# Altium schematic sheet ADC.SchDoc
size 420 x 594 mm; SheetNumber: 3; INDEX: СЛИЮ.687282.064 Э3
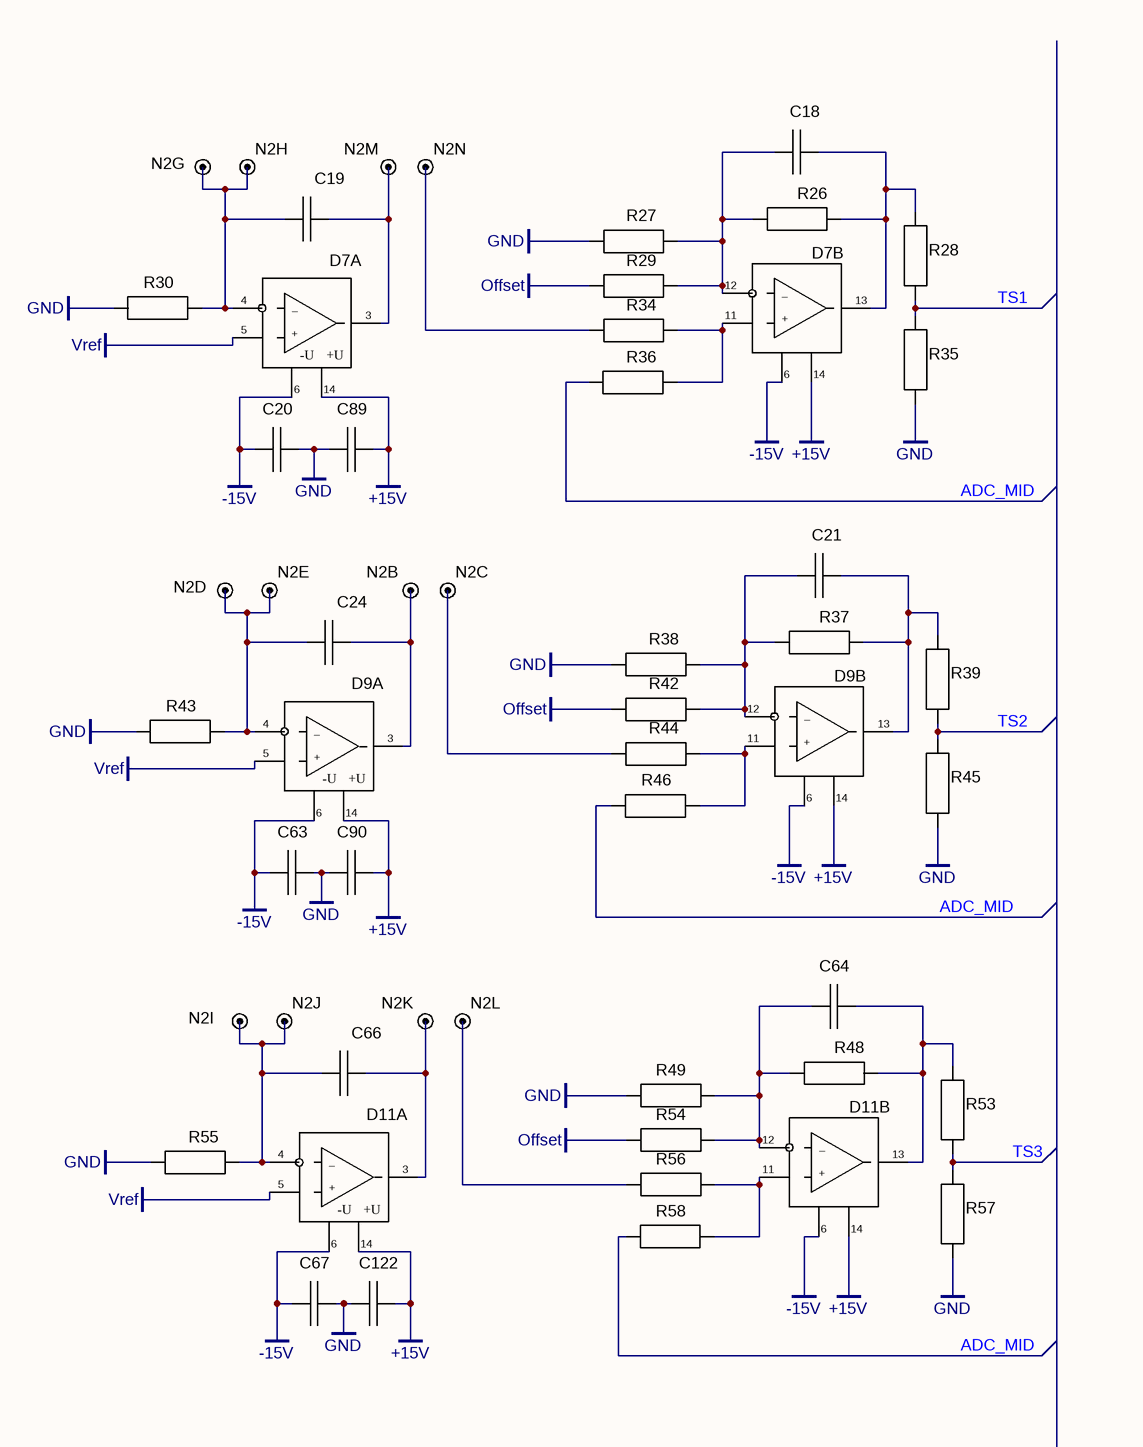
[diagram p0: ADC.SchDoc, top]
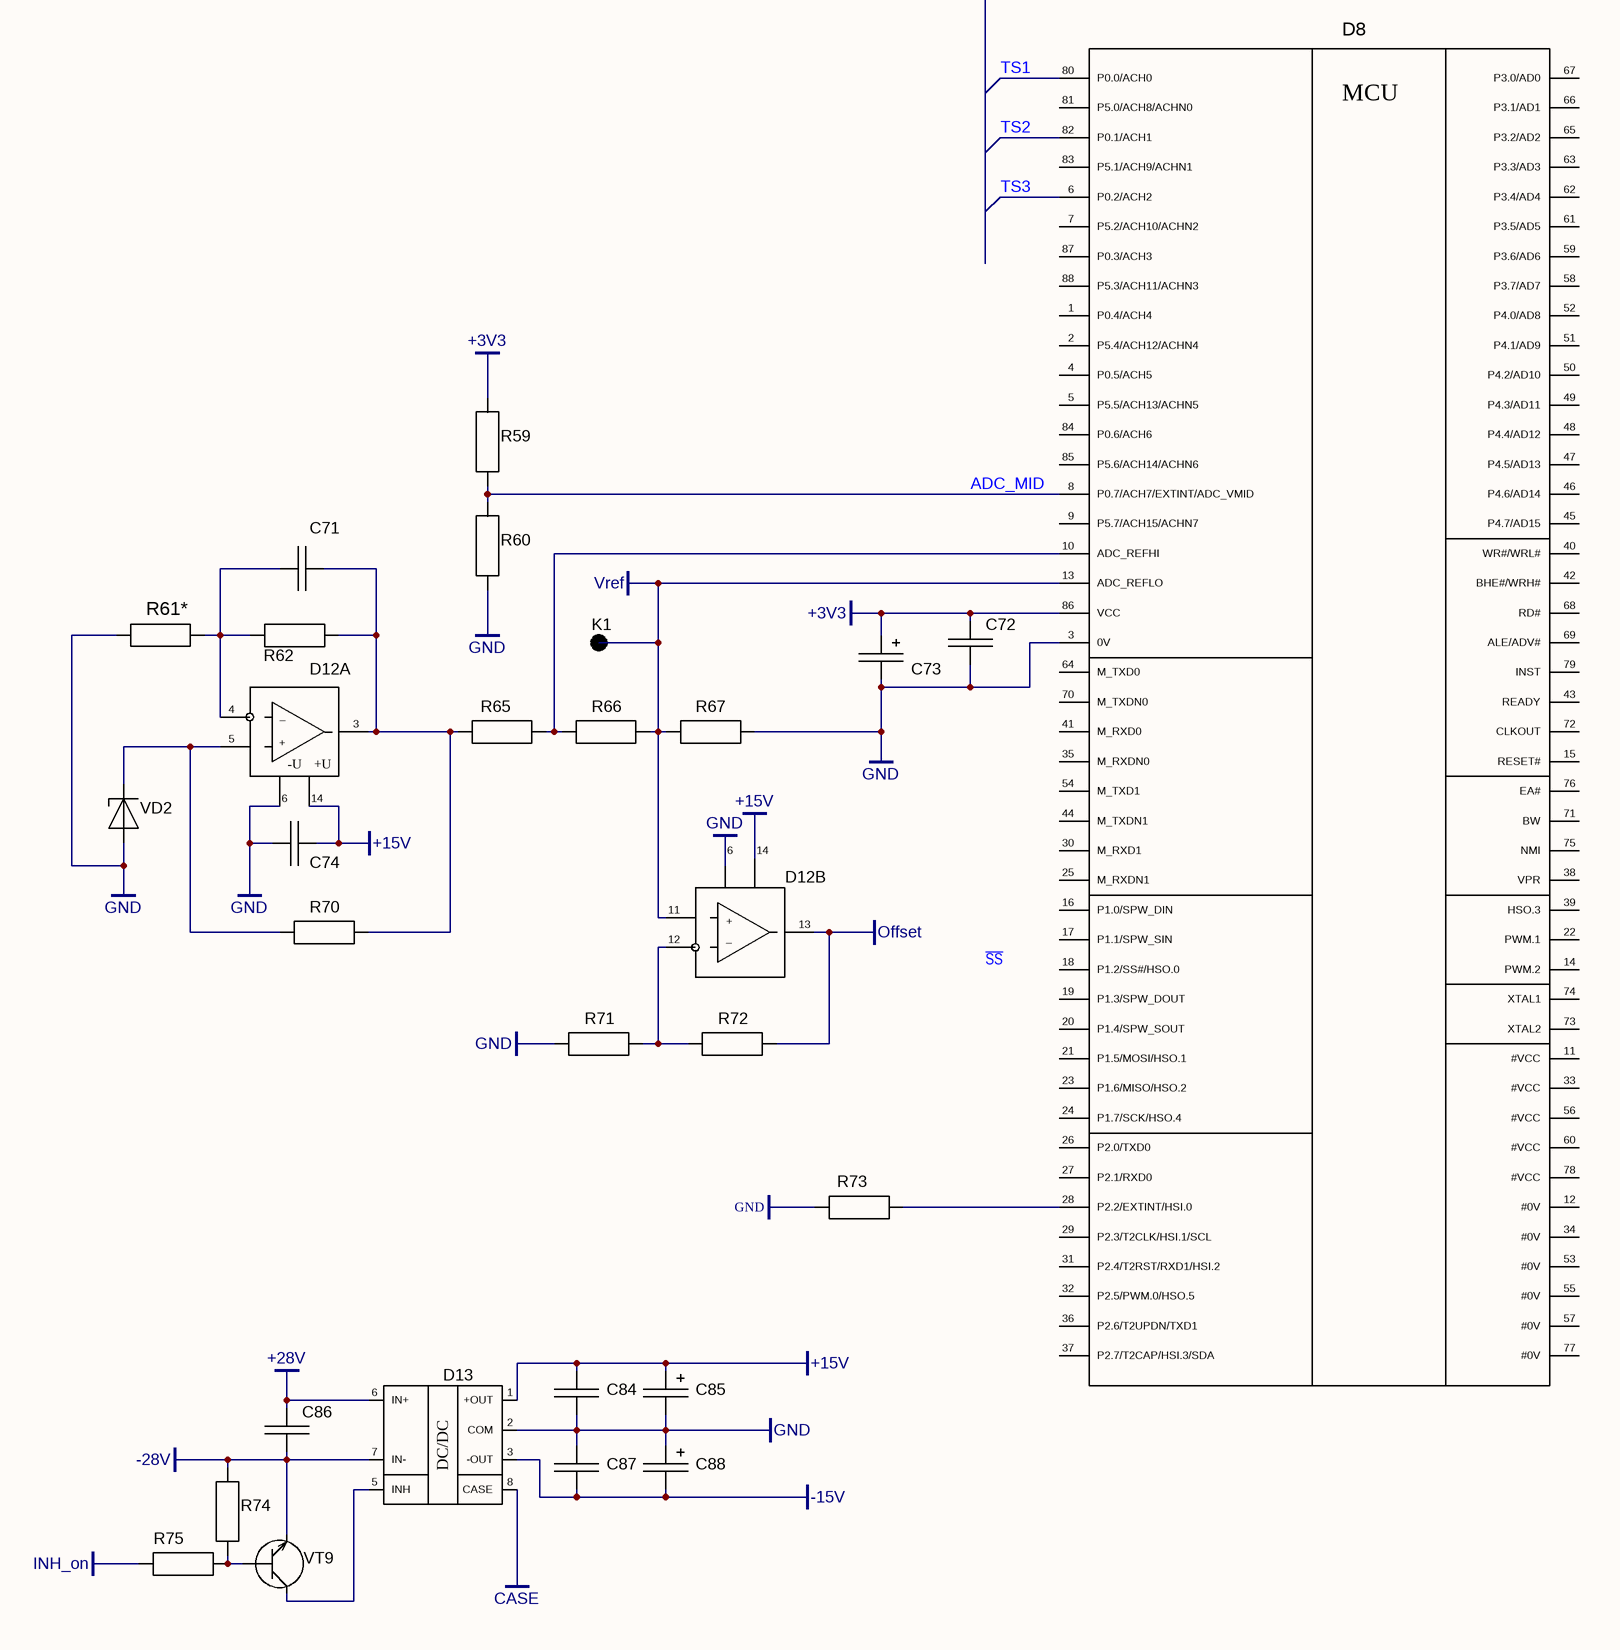
[diagram p1: ADC.SchDoc, bottom]

## Parts
C18  (no value)  [K1017V_4]
C19  (no value)  [K1017V_4]
C20  (no value)  [K1017V_4]
C21  (no value)  [K1017V_4]
C24  (no value)  [K1017V_4]
C63  (no value)  [K1017V_4]
C64  (no value)  [K1017V_4]
C66  (no value)  [K1017V_4]
C67  (no value)  [K1017V_4]
C71  (no value)  [K1017V_4]
C72  (no value)  [K1017V_4]
C73  (no value)  [K53_56A_TYPE2]
C74  (no value)  [K1017V_4]
C84  (no value)  [K1017V_5]
C85  (no value)  [K53_56A_TYPE3]
C86  (no value)  [K1047V_3]
C87  (no value)  [K1017V_5]
C88  (no value)  [K53_56A_TYPE3]
C89  (no value)  [K1017V_4]
C90  (no value)  [K1017V_4]
C122  (no value)  [K1017V_4]
D7  (no value)  [H04_16_1B]  (parts A,B of 2)
D8  (no value)  [4235_88_1_275]
D9  (no value)  [H04_16_1B]  (parts A,B of 2)
D11  (no value)  [H04_16_1B]  (parts A,B of 2)
D12  (no value)  [H04_16_1B]  (parts A,B of 2)
D13  (no value)  [SMSA2805S]
K1  K  [K]  (value not drawn)
N2  (no value)  [KOL26]  (parts B,C,D,E,G,H,I,J,K,L,M,N of 26)
R26  (no value)  [R1_8MP_0W125]
R27  (no value)  [R1_8MP_0W125]
R28  (no value)  [R1_8MP_0W125]
R29  (no value)  [R1_8MP_0W125]
R30  (no value)  [R1_8MP_0W125]
R34  (no value)  [R1_8MP_0W125]
R35  (no value)  [R1_8MP_0W125]
R36  (no value)  [R1_8MP_0W125]
R37  (no value)  [R1_8MP_0W125]
R38  (no value)  [R1_8MP_0W125]
R39  (no value)  [R1_8MP_0W125]
R42  (no value)  [R1_8MP_0W125]
R43  (no value)  [R1_8MP_0W125]
R44  (no value)  [R1_8MP_0W125]
R45  (no value)  [R1_8MP_0W125]
R46  (no value)  [R1_8MP_0W125]
R48  (no value)  [R1_8MP_0W125]
R49  (no value)  [R1_8MP_0W125]
R53  (no value)  [R1_8MP_0W125]
R54  (no value)  [R1_8MP_0W125]
R55  (no value)  [R1_8MP_0W125]
R56  (no value)  [R1_8MP_0W125]
R57  (no value)  [R1_8MP_0W125]
R58  (no value)  [R1_8MP_0W125]
R59  (no value)  [R1_112_W125]
R60  (no value)  [R1_112_W125]
R61*  (no value)  [C2_29V_0W125]
R62  (no value)  [R1_8MP_0W125]
R65  (no value)  [R1_8MP_0W125]
R66  (no value)  [R1_8MP_0W125]
R67  (no value)  [R1_8MP_0W125]
R70  (no value)  [R1_8MP_0W125]
R71  (no value)  [R1_8MP_0W125]
R72  (no value)  [R1_8MP_0W125]
R73  (no value)  [R1_112_W125]
R74  (no value)  [R1_112_W125]
R75  (no value)  [R1_112_W125]
VD2  (no value)  [2S222G]
VT9  2T665A91  [2T665A91]  (value not drawn)

## Nets
+3V3: C72.2 C73.Plus D8.86(VCC) R59.2
+15V: C74.1 C84.2 C85.Plus C89.2 C90.2 C122.2 D7.14(+U) D9.14(+U) D11.14(+U) D12.14(+U) D13.1(+OUT)
+28V: C86.2 D13.6(IN+)
-15V: C20.1 C63.1 C67.1 C87.1 C88.Minus D7.6(-U) D9.6(-U) D11.6(-U) D13.3(-OUT)
-28V: C86.1 D13.7(IN-) R74.2 VT9.E
CASE: D13.8(CASE)
GND: C20.2 C63.2 C67.2 C72.1 C73.Minus C74.2 C84.1 C85.Minus C87.2 C88.Plus C89.1 C90.1 C122.1 D8.3(0V) D12.6(-U) D13.2(COM) R27.1 R30.2 R35.1 R38.1 R43.2 R45.1 R49.1 R55.2 R57.1 R60.1 R61*.1(i/o) R67.2 R71.2 R73.1 VD2.A
INH_on: R75.1
Offset: D12.13(OUT) R29.1 R42.1 R54.1 R72.1
Vref: D7.5(IN+) D8.13(ADC_REFLO) D9.5(IN+) D11.5(IN+) D12.11(IN+) K1.1 R66.1 R67.1
ADC_MID: D8.8(P0.7/ACH7/EXTINT/ADC_VMID) R36.2 R46.2 R58.2 R59.1 R60.2
TS1: D8.80(P0.0/ACH0) R28.1 R35.2
TS2: D8.82(P0.1/ACH1) R39.1 R45.2
TS3: D8.6(P0.2/ACH2) R53.1 R57.2
NetC18_1: C18.1 D7.12(IN-) R26.1 R27.2 R29.2
NetC18_2: C18.2 D7.13(OUT) R26.2 R28.2
NetC19_1: C19.1 D7.4(IN-) N2.7 N2.8 R30.1
NetC19_2: C19.2 D7.3(OUT) N2.13
NetC21_1: C21.1 D9.12(IN-) R37.1 R38.2 R42.2
NetC21_2: C21.2 D9.13(OUT) R37.2 R39.2
NetC24_1: C24.1 D9.4(IN-) N2.4 N2.5 R43.1
NetC24_2: C24.2 D9.3(OUT) N2.2
NetC64_1: C64.1 D11.12(IN-) R48.1 R49.2 R54.2
NetC64_2: C64.2 D11.13(OUT) R48.2 R53.2
NetC66_1: C66.1 D11.4(IN-) N2.9 N2.10 R55.1
NetC66_2: C66.2 D11.3(OUT) N2.11
NetC71_1: C71.1 D12.4(IN-) R61*.2(i/o) R62.1
NetC71_2: C71.2 D12.3(OUT) R62.2 R65.2 R70.2
NetD7_11: D7.11(IN+) R34.2 R36.1
NetD8_10: D8.10(ADC_REFHI) R65.1 R66.2
NetD8_28: D8.28(P2.2/EXTINT/HSI.0) R73.2
NetD9_11: D9.11(IN+) R44.2 R46.1
NetD11_11: D11.11(IN+) R56.2 R58.1
NetD12_5: D12.5(IN+) R70.1 VD2.C
NetD12_12: D12.12(IN-) R71.1 R72.2
NetD13_5: D13.5(INH) VT9.C
NetN2_3: N2.3 R44.1
NetN2_12: N2.12 R56.1
NetN2_14: N2.14 R34.1
NetR74_1: R74.1 R75.2 VT9.B

Not connected (* = marked no-connect by the designer): D7 1 2 7 8 9 10 15 16; D8 1(P0.4/ACH4) 2(P5.4/ACH12/ACHN4) 4(P0.5/ACH5) 5(P5.5/ACH13/ACHN5) 7(P5.2/ACH10/ACHN2) 9(P5.7/ACH15/ACHN7) 11(#VCC) 12(#0V) 14(PWM.2) 15(RESET#) 16(P1.0/SPW_DIN) 17(P1.1/SPW_SIN) 18(P1.2/SS#/HSO.0) 19(P1.3/SPW_DOUT) 20(P1.4/SPW_SOUT) 21(P1.5/MOSI/HSO.1) 22(PWM.1) 23(P1.6/MISO/HSO.2) 24(P1.7/SCK/HSO.4) 25(M_RXDN1) 26(P2.0/TXD0) 27(P2.1/RXD0) 29(P2.3/T2CLK/HSI.1/SCL) 30(M_RXD1) 31(P2.4/T2RST/RXD1/HSI.2) 32(P2.5/PWM.0/HSO.5) 33(#VCC) 34(#0V) 35(M_RXDN0) 36(P2.6/T2UPDN/TXD1) 37(P2.7/T2CAP/HSI.3/SDA) 38(VPR) 39(HSO.3) 40(WR#/WRL#) 41(M_RXD0) 42(BHE#/WRH#) 43(READY) 44(M_TXDN1) 45(P4.7/AD15) 46(P4.6/AD14) 47(P4.5/AD13) 48(P4.4/AD12) 49(P4.3/AD11) 50(P4.2/AD10) 51(P4.1/AD9) 52(P4.0/AD8) 53(#0V) 54(M_TXD1) 55(#0V) 56(#VCC) 57(#0V) 58(P3.7/AD7) 59(P3.6/AD6) 60(#VCC) 61(P3.5/AD5) 62(P3.4/AD4) 63(P3.3/AD3) 64(M_TXD0) 65(P3.2/AD2) 66(P3.1/AD1) 67(P3.0/AD0) 68(RD#) 69(ALE/ADV#) 70(M_TXDN0) 71(BW) 72(CLKOUT) 73(XTAL2) 74(XTAL1) 75(NMI) 76(EA#) 77(#0V) 78(#VCC) 79(INST) 81(P5.0/ACH8/ACHN0) 83(P5.1/ACH9/ACHN1) 84(P0.6/ACH6) 85(P5.6/ACH14/ACHN6) 87(P0.3/ACH3) 88(P5.3/ACH11/ACHN3); D9 1 2 7 8 9 10 15 16; D11 1 2 7 8 9 10 15 16; D12 1 2 7 8 9 10 15 16; D13 4

## Notes on the sheet
- Labels drawn without touching a wire or pin: ~{SS}
- Подпись и дата
- Инв.№ дубл.
- Взам. инв. №
- Инв. № подл.
- Лист
- Изм.
- №  докум.
- Подпись
- Дата
- (in symbol 544UD16U3, part A) –; +
- (in symbol 544UD16U3, part B) +; –
- (in symbol 1874VE7T) MCU
- (in symbol SMSA2815D_KR) DC/DC

## Library data of the parts
C18 C19 C21 C24 C64 C66 C71 = K10-17V-N50-0u015F: K10_17V_N50_4; mass: 0.1; Value: 0.015 uF; ValueType: Конденсатор; ValueScreening: ОС; ValueName: К10-17в-Н50-0,015 мкФ; ValueTechReq: ОЖО.460.107ТУ, ОЖО.460.183ТУ; ValueDescription: TYPE4; Part Number: K10-17V-N50-0u015F; ComponentLink1URL: C:\AltiumLib\pdf\k1017v.pdf; ComponentLink1Description: Datasheet
C20 C63 C67 C72 C74 C89 C90 C122 = K10-17V-N90-0u068F: ChipCapasitor; mass: 0.1; Value: 0.068 uF; ValueType: Конденсатор; ValueScreening: ОС; ValueName: К10-17в-Н90-0,068 мкФ; ValueTechReq: ОЖО.460.107ТУ, ОЖО.460.183ТУ; ValueDescription: TYPE4; Part Number: K10-17V-N90-0u068F; ComponentLink1URL: C:\AltiumLib\pdf\k1017v.pdf; ComponentLink1Description: Datasheet
C73 = K53-56-6.3V-10uF±20: TYPE2; mass: 0.08(для варианта А=0,065); Value: 10 uF; ValueType: Конденсатор; ValueScreening: ОСМ; ValueName: К53-56-6,3В-10 мкФ±20%-В; ValueTechReq: АЖЯР.673546.001ТУ, П0.070.052; Part Number: K53-56-6.3V-10uF±20; ComponentLink1URL: C:\AltiumLib\pdf\K53-56.pdf; ComponentLink1Description: Datasheet
C84 C87 = K10-17V-N90-0u1F: K10_17V_N90_5; mass: 0.2; Value: 0.1 uF; ValueType: Конденсатор; ValueScreening: ОС; ValueName: К10-17в-Н90-0,1 мкФ; ValueTechReq: ОЖО.460.107ТУ, ОЖО.460.183ТУ; ValueDescription: TYPE5; Part Number: K10-17V-N90-0u1F; ComponentLink1URL: C:\AltiumLib\pdf\k1017v.pdf; ComponentLink1Description: Datasheet
C85 C88 = K53-56-20V-10uF±20: TYPE3; mass: 0.25; Value: 10 uF; ValueType: Конденсатор; ValueScreening: ОСМ; ValueName: К53-56-20В-10 мкФ±20%-В; ValueTechReq: АЖЯР.673546.001ТУ, П0.070.052; Part Number: K53-56-20V-10uF±20; ComponentLink1URL: C:\AltiumLib\pdf\K53-56.pdf; ComponentLink1Description: Datasheet
C86 = K10-47V-50V-0u47F: ChipCapasitor; mass: 1.5; Value: 0.47 uF; ValueType: Конденсатор; ValueScreening: ОС; ValueName: К10-47в-50В-0,47 мкФ; ValueTechReq: ОЖО.460.174ТУ, ОЖО.460.183ТУ; Part Number: K10-47V-50V-0u47F; ComponentLink1URL: C:\AltiumLib\pdf\k10-47vp.pdf; ComponentLink1Description: Datasheet
D7 D9 D11 D12 = 544UD16U3: operational amplifier; Ustanovka;Formovka: 44и.3266.145; Mass: 1; ValueType: Микросхема; ValueName: 544УД16У3; ValueTechReq: АЕЯР.431130.510ТУ; Part Number: 544UD16U3; Package: H04.16-1B; ComponentLink1URL: C:\AltiumLib\pdf\544UD16U3.pdf; ComponentLink1Description: Datasheet
D8 = 1874VE7T: 16-bit microcontroller (based on MCS-96); ValueType: Микросхема; ValueName: 1874ВЕ7Т; ValueTechReq: АЕЯР.431280.903ТУ; Ustanovka;Formovka: 34;44в.3263.275.18; Mass: 4.5; Primenenie: MU; Part Number: 1874VE7T; ComponentLink1Description: Datasheet; Package: 4235.88-1; ComponentLink1URL: C:\AltiumLib\pdf\1874ВЕ7Т.pdf
D13 = SMSA2815D_KR: DC/DC 5W dual; Mass, Prokladka: 15g,372ПЗ21.11Ю4100-82; ValueType: Модуль питания; ValueName: SMSA2815D/KR; Part Number: SMSA2815D_KR; ComponentLink1URL: C:\AltiumLib\pdf\smsa28.pdf; ComponentLink1Description: Datasheet
N2 = bSNP333-26: board analog SNP333-26; ValueType: Соединитель; ValueName: БСНП333-26; Part Number: bSNP333-26; ComponentLink1Description: Datasheet
R26 R37 R48 = R1-8MP-0w125-1003±0,1: chip; Value: 100k; ValueType: Резистор; ValueName: Р1-8МП-0,125-100 кОм±0,1%-0,5-Л; ValueTechReq: ОЖ0.467.164ТУ, П0.070.052; Mass: 0.01; Part Number: R1-8MP-0W125-1003±0,1; ComponentLink1Description: Datasheet
R27 R38 R49 = R1-8MP-0w125-2492±0,1: chip; Value: 24.9k; ValueType: Резистор; ValueName: Р1-8МП-0,125-24,9 кОм±0,1%-0,5-Л; ValueTechReq: ОЖ0.467.164ТУ, П0.070.052; Mass: 0.01; Part Number: R1-8MP-0W125-2492±0,1; ComponentLink1Description: Datasheet
R28 R39 R53 = R1-8MP-0w125-2051±0,5: chip; Value: 2.05k; ValueType: Резистор; ValueName: Р1-8МП-0,125-2,05 кОм±0,5%-0,5-Л; ValueTechReq: ОЖ0.467.164ТУ, П0.070.052; Mass: 0.01; Part Number: R1-8MP-0W125-2051±0,5; ComponentLink1Description: Datasheet
R29 R34 R36 R42 R44 R46 R54 R56 R58 = R1-8MP-0w125-2052±0,1: chip; Value: 20.5k; ValueType: Резистор; ValueName: Р1-8МП-0,125-20,5 кОм±0,1%-0,5-Л; ValueTechReq: ОЖ0.467.164ТУ, П0.070.052; Mass: 0.01; Part Number: R1-8MP-0W125-2052±0,1; ComponentLink1Description: Datasheet
R30 R43 R55 R67 R71 = R1-8MP-0W125-1001±0,5: chip; Value: 1k; ValueType: Резистор; ValueName: Р1-8МП-0,125-1 кОм±0,5%-0,5-Л; ValueTechReq: ОЖ0.467.164ТУ, П0.070.052; Mass: 0.01; Part Number: R1-8MP-0W125-1001±0,5; ComponentLink1Description: Datasheet
R35 R45 R57 = R1-8MP-0w125-5110±0,5: chip; Value: 511; ValueType: Резистор; ValueName: Р1-8МП-0,125-511 Ом±0,5%-0,5-Л; ValueTechReq: ОЖ0.467.164ТУ, П0.070.052; Mass: 0.01; Part Number: R1-8MP-0W125-5110±0,5; ComponentLink1Description: Datasheet
R59 R60 = R1-112-0W125-623±5: chip; Value: 62k; ValueType: Резистор; ValueName: Р1-112-0,125-62 кОм±5%-К-А; ValueTechReq: ДАРГ.434110.004ТУ; Mass: 0.006; Part Number: R1-112-0W125-623±5; ComponentLink1URL: C:\AltiumLib\pdf\ТУ_Р1-112.pdf; ComponentLink1Description: Datasheet
R61* = C2-29V-0W125-6491±0_1: ValueType: Резистор; ValueName: C2-29В-0,125-6,49 кОм±0,1%; ValueTechReq: ОЖО.467.138ТУ, ОЖО.467.099ТУ; Value: 6.49; Mass: 0.3; Ustanovka;Formovka: 3:25.0092.193.15; Part Number: C2-29V-0W125-6491±0_1
R62 = R1-8MP-0w125-3651±0,1: chip; Value: 3.65k; ValueType: Резистор; ValueName: Р1-8МП-0,125-3,65 кОм±0,1%-0,5-Л; ValueTechReq: ОЖ0.467.164ТУ, П0.070.052; Mass: 0.01; Part Number: R1-8MP-0W125-3651±0,1; ComponentLink1Description: Datasheet
R65 = R1-8MP-0w125-7681±0,1: chip; Value: 7.68k; ValueType: Резистор; ValueName: Р1-8МП-0,125-7,68 кОм±0,1%-0,5-Л; ValueTechReq: ОЖ0.467.164ТУ, П0.070.052; Mass: 0.01; Part Number: R1-8MP-0W125-7681±0,1; ComponentLink1Description: Datasheet
R66 = R1-8MP-0w125-1331±0,1: chip; Value: 1.33k; ValueType: Резистор; ValueName: Р1-8МП-0,125-1,33 кОм±0,1%-0,5-Л; ValueTechReq: ОЖ0.467.164ТУ, П0.070.052; Mass: 0.01; Part Number: R1-8MP-0W125-1331±0,1; ComponentLink1Description: Datasheet
R70 = R1-8MP-0w125-4870±0,5: chip; Value: 487; ValueType: Резистор; ValueName: Р1-8МП-0,125-487 Ом±0,5%-0,5-Л; ValueTechReq: ОЖ0.467.164ТУ, П0.070.052; Mass: 0.01; Part Number: R1-8MP-0W125-4870±0,5; ComponentLink1Description: Datasheet
R72 = R1-8MP-0w125-2801±0,5: chip; Value: 2.8k; ValueType: Резистор; ValueName: Р1-8МП-0,125-2,8 кОм±0,5%-0,5-Л; ValueTechReq: ОЖ0.467.164ТУ, П0.070.052; Mass: 0.01; Part Number: R1-8MP-0W125-2801±0,5; ComponentLink1Description: Datasheet
R73 = R1-112-0W125-101±5: chip; Value: 100; ValueType: Резистор; ValueName: Р1-112-0,125-100 Ом±5%-К-А; ValueTechReq: ДАРГ.434110.004ТУ; Mass: 0.006; Part Number: R1-112-0W125-101±5; ComponentLink1URL: C:\AltiumLib\pdf\ТУ_Р1-112.pdf; ComponentLink1Description: Datasheet
R74 = R1-112-0W125-302±5: chip; Value: 3k; ValueType: Резистор; ValueName: Р1-112-0,125-3 кОм±5%-К-А; ValueTechReq: ДАРГ.434110.004ТУ; Mass: 0.006; Part Number: R1-112-0W125-302±5; ComponentLink1URL: C:\AltiumLib\pdf\ТУ_Р1-112.pdf; ComponentLink1Description: Datasheet
R75 = R1-112-0W125-273±5: chip; Value: 27k; ValueType: Резистор; ValueName: Р1-112-0,125-27 кОм±5%-К-А; ValueTechReq: ДАРГ.434110.004ТУ; Mass: 0.006; Part Number: R1-112-0W125-273±5; ComponentLink1URL: C:\AltiumLib\pdf\ТУ_Р1-112.pdf; ComponentLink1Description: Datasheet
VD2 = 2S108D: Ustanovka;Formovka: 3;25.2057.193.13; Mass: 0,2; ValueType: Стабилитрон; ValueName: 2С108Д; ValueTechReq: аА0.339.436ТУ; Part Number: 2S108D
VT9 = 2T665A91: n-p-n; TechReq: АЕЯР.432140.561ТУ; mass: 0.15g; Part Number: 2T665A91; ComponentLink1Description: Datasheet
K1 = K: Part Number: K; ComponentLink1Description: Datasheet